# EAGLE schematic Comm Channel Display (EAGLE 9.6.2)
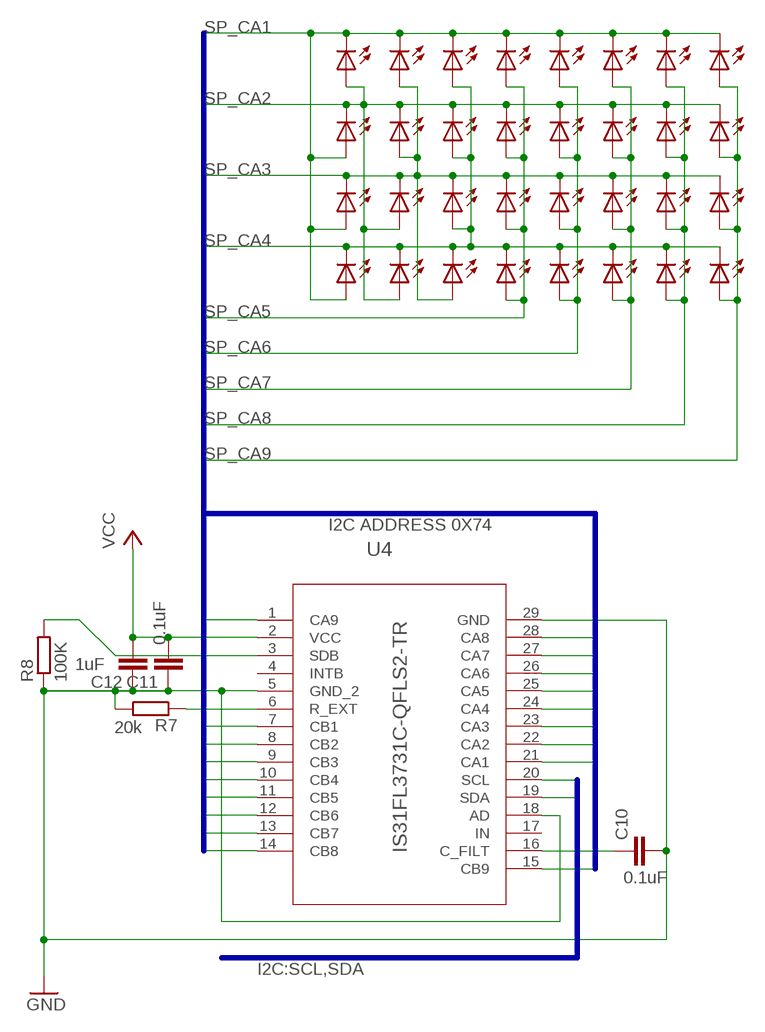
[diagram p0: schematic, sheet 1]

## Parts
C10  0.1uF  C-EUC0201  [C0201]
C11  0.1uF  C-EUC0402  [C0402]
C12  1uF  C-EUC0402  [C0402]
LED_A3  LEDSMT0603_1  [CHIPLED_0603]
LED_A4  LEDSMT0603_1  [CHIPLED_0603]
LED_B3  LEDSMT0603_1  [CHIPLED_0603]
LED_B4  LEDSMT0603_1  [CHIPLED_0603]
LED_C3  LEDSMT0603_1  [CHIPLED_0603]
LED_C4  LEDSMT0603_1  [CHIPLED_0603]
LED_D3  LEDSMT0603_1  [CHIPLED_0603]
LED_D4  LEDSMT0603_1  [CHIPLED_0603]
LED_E3  LEDSMT0603_1  [CHIPLED_0603]
LED_E4  LEDSMT0603_1  [CHIPLED_0603]
LED_F3  LEDSMT0603_1  [CHIPLED_0603]
LED_F4  LEDSMT0603_1  [CHIPLED_0603]
LED_G3  LEDSMT0603_1  [CHIPLED_0603]
LED_G4  LEDSMT0603_1  [CHIPLED_0603]
LED_H3  LEDSMT0603_1  [CHIPLED_0603]
LED_H4  LEDSMT0603_1  [CHIPLED_0603]
LED_K3  LEDSMT0603_1  [CHIPLED_0603]
LED_K4  LEDSMT0603_1  [CHIPLED_0603]
LED_M3  LEDSMT0603_1  [CHIPLED_0603]
LED_M4  LEDSMT0603_1  [CHIPLED_0603]
LED_N3  LEDSMT0603_1  [CHIPLED_0603]
LED_N4  LEDSMT0603_1  [CHIPLED_0603]
LED_P3  LEDSMT0603_1  [CHIPLED_0603]
LED_P4  LEDSMT0603_1  [CHIPLED_0603]
LED_R3  LEDSMT0603_1  [CHIPLED_0603]
LED_R4  LEDSMT0603_1  [CHIPLED_0603]
LED_S3  LEDSMT0603_1  [CHIPLED_0603]
LED_S4  LEDSMT0603_1  [CHIPLED_0603]
LED_T3  LEDSMT0603_1  [CHIPLED_0603]
LED_T4  LEDSMT0603_1  [CHIPLED_0603]
LED_U3  LEDSMT0603_1  [CHIPLED_0603]
LED_U4  LEDSMT0603_1  [CHIPLED_0603]
R7  20k  R-EU_R0805  [R0805]
R8  100K  R-EU_R0201  [R0201]
U4  IS31FL3731C-QFLS2-TR  [QFN-28_ISI]

## Nets
GND: C10.2 C11.1 C12.1 R7.2 R8.1 U4.5(GND_2) U4.18(AD) U4.29(GND)
N$10: C10.1 U4.16(C_FILT)
N$11: R8.2 U4.3(SDB)
N$12: R7.1 U4.6(R_EXT)
SCL: U4.20(SCL)
SDA: U4.19(SDA)
SP_CA1: LED_A3.C LED_A4.A LED_B3.C LED_C3.C LED_D3.C LED_E3.C LED_F3.C LED_G3.C LED_H3.C LED_K3.A LED_K4.A U4.21(CA1)
SP_CA2: LED_A3.A LED_B4.A LED_K3.C LED_M3.C LED_M4.A LED_N3.C LED_P3.C LED_R3.C LED_S3.C LED_T3.C LED_U3.C U4.22(CA2)
SP_CA3: LED_A4.C LED_B3.A LED_B4.C LED_C4.C LED_D4.C LED_E4.C LED_F4.C LED_G4.C LED_H4.C LED_M3.A LED_N4.A U4.23(CA3)
SP_CA4: LED_C3.A LED_C4.A LED_K4.C LED_M4.C LED_N3.A LED_N4.C LED_P4.C LED_R4.C LED_S4.C LED_T4.C LED_U4.C U4.24(CA4)
SP_CA5: LED_D3.A LED_D4.A LED_P3.A LED_P4.A U4.25(CA5)
SP_CA6: LED_E3.A LED_E4.A LED_R3.A LED_R4.A U4.26(CA6)
SP_CA7: LED_F3.A LED_F4.A LED_S3.A LED_S4.A
SP_CA8: LED_G3.A LED_G4.A LED_T3.A LED_T4.A U4.28(CA8)
SP_CA9: LED_H3.A LED_H4.A LED_U3.A LED_U4.A U4.1(CA9)
SP_CB1: U4.7(CB1)
SP_CB2: U4.8(CB2)
SP_CB3: U4.9(CB3)
SP_CB4: U4.10(CB4)
SP_CB5: U4.11(CB5)
SP_CB6: U4.12(CB6)
SP_CB7: U4.13(CB7) U4.27(CA7)
SP_CB8: U4.14(CB8)
SP_CB9: U4.15(CB9)
VCC: C11.2 C12.2 U4.2(VCC)
Unconnected: U4.4(INTB) U4.17(IN)

## Buses
SP_CA1,SP_CA2,SP_CA3,SP_CA4,SP_CA5,SP_CA6,SP_CA7,SP_CA8,SP_CA9,SP_CB1,SP_CB2,SP_CB3,SP_CB4,SP_CB5,SP_CB6,SP_CB7,SP_CB8,SP_CB9
I2C:SCL,SDA

## Notes on the sheet
- I2C ADDRESS 0X74

## Library data of the parts
C10-C12 = rcl:C-EU: CAPACITOR, European symbol; SPICEPREFIX: C
LED_A3 LED_A4 LED_B3 LED_B4 LED_C3 LED_C4 LED_D3 LED_D4 LED_E3 LED_E4 LED_F3 LED_F4 LED_G3 LED_G4 LED_H3 LED_H4 LED_K3 LED_K4 LED_M3 LED_M4 LED_N3 LED_N4 LED_P3 LED_P4 LED_R3 LED_R4 LED_S3 LED_S4 LED_T3 LED_T4 LED_U3 LED_U4 = 000_nl2:LED: LED KINGBRIGHT: KPTL-3216 are the reverse LEDs Source: www.kingbright.com
R7 R8 = rcl:R-EU_: RESISTOR, European symbol; SPICEPREFIX: R
U4 = 000_nl2:IS31FL3731C-QFLS2-TR; BUILT_BY: EMA_Cory; COPYRIGHT: Copyright (C) 2018 Accelerated Designs. All rights reserved; DATASHEET: http://www.issi.com/WW/pdf/31FL3731.pdf; MANUFACTURER_PART_NUMBER: IS31FL3731C-QFLS2-TR; SOURCELIBRARY: ISSI_2020-07-08; VENDOR: ISSI